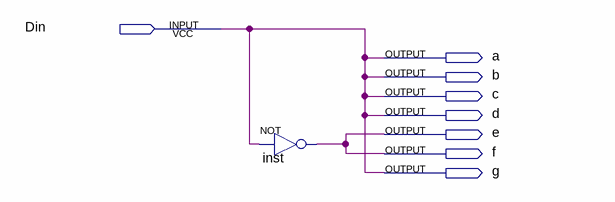
[diagram p0: schematic sheet]
// Quartus schematic render_tapeSymbol_3.bdf as structural Verilog: 1 symbols, 8 pins
module render_tapeSymbol_3 (
  input  Din,
  output a,
  output b,
  output c,
  output d,
  output e,
  output f,
  output g
);

  not inst (e, Din);

  assign a = Din;
  assign b = Din;
  assign c = Din;
  assign d = Din;
  assign f = e;
  assign g = Din;
endmodule
